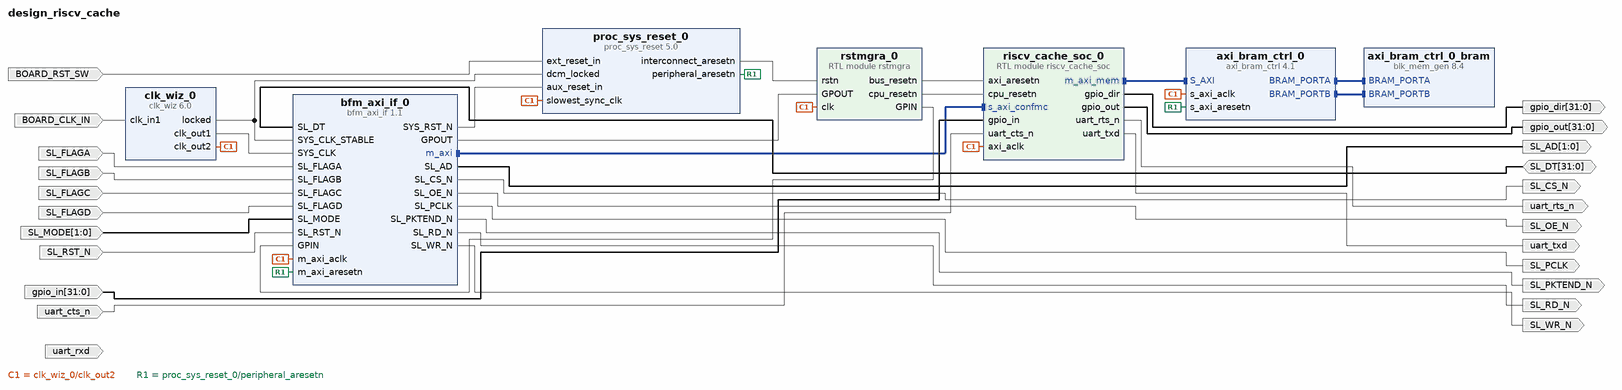
[diagram p0: block diagram of the top level]
# Vivado block design design_riscv_cache, xc7z020clg484-1, Vivado 2021.2
create_bd_design design_riscv_cache

create_bd_port -dir I -type clk BOARD_CLK_IN
set_property -dict {CONFIG.FREQ_HZ 100000000} [get_bd_ports BOARD_CLK_IN]
create_bd_port -dir I -type rst BOARD_RST_SW
set_property -dict {CONFIG.POLARITY ACTIVE_HIGH} [get_bd_ports BOARD_RST_SW]
create_bd_port -dir O -from 1 -to 0 SL_AD
create_bd_port -dir O SL_CS_N
create_bd_port -dir IO -from 31 -to 0 SL_DT
create_bd_port -dir I SL_FLAGA
create_bd_port -dir I SL_FLAGB
create_bd_port -dir I SL_FLAGC
create_bd_port -dir I SL_FLAGD
create_bd_port -dir I -from 1 -to 0 SL_MODE
create_bd_port -dir O SL_OE_N
create_bd_port -dir O SL_PCLK
create_bd_port -dir O SL_PKTEND_N
create_bd_port -dir O SL_RD_N
create_bd_port -dir I -type rst SL_RST_N
create_bd_port -dir O SL_WR_N
create_bd_port -dir I uart_cts_n
create_bd_port -dir O uart_rts_n
create_bd_port -dir I uart_rxd
create_bd_port -dir O uart_txd
create_bd_port -dir I -from 31 -to 0 gpio_in
create_bd_port -dir O -from 31 -to 0 gpio_out
create_bd_port -dir O -from 31 -to 0 gpio_dir

create_bd_cell -type ip -vlnv xilinx.com:ip:axi_bram_ctrl:4.1 axi_bram_ctrl_0
create_bd_cell -type ip -vlnv xilinx.com:ip:blk_mem_gen:8.4 axi_bram_ctrl_0_bram
set_property -dict {CONFIG.Memory_Type True_Dual_Port_RAM} [get_bd_cells axi_bram_ctrl_0_bram]
create_bd_cell -type ip -vlnv future-ds.com:user:bfm_axi_if:1.1 bfm_axi_if_0
create_bd_cell -type ip -vlnv xilinx.com:ip:clk_wiz:6.0 clk_wiz_0
set_property -dict [list \
  CONFIG.CLKOUT1_JITTER 137.143 \
  CONFIG.CLKOUT1_REQUESTED_OUT_FREQ 80 \
  CONFIG.CLKOUT2_JITTER 130.958 \
  CONFIG.CLKOUT2_PHASE_ERROR 98.575 \
  CONFIG.CLKOUT2_USED true \
  CONFIG.MMCM_CLKOUT0_DIVIDE_F 12.500 \
  CONFIG.MMCM_CLKOUT1_DIVIDE 10 \
  CONFIG.NUM_OUT_CLKS 2 \
  CONFIG.USE_RESET false \
] [get_bd_cells clk_wiz_0]
create_bd_cell -type ip -vlnv xilinx.com:ip:proc_sys_reset:5.0 proc_sys_reset_0
create_bd_cell -type module -reference riscv_cache_soc riscv_cache_soc_0
create_bd_cell -type module -reference rstmgra rstmgra_0

# ---- connections ----

connect_bd_intf_net [get_bd_intf_pins axi_bram_ctrl_0/BRAM_PORTA] [get_bd_intf_pins axi_bram_ctrl_0_bram/BRAM_PORTA]
connect_bd_intf_net [get_bd_intf_pins axi_bram_ctrl_0/BRAM_PORTB] [get_bd_intf_pins axi_bram_ctrl_0_bram/BRAM_PORTB]
connect_bd_intf_net [get_bd_intf_pins bfm_axi_if_0/m_axi] [get_bd_intf_pins riscv_cache_soc_0/s_axi_confmc]
connect_bd_intf_net [get_bd_intf_pins axi_bram_ctrl_0/S_AXI] [get_bd_intf_pins riscv_cache_soc_0/m_axi_mem]
connect_bd_net [get_bd_ports BOARD_CLK_IN] [get_bd_pins clk_wiz_0/clk_in1]
connect_bd_net [get_bd_ports BOARD_RST_SW] [get_bd_pins proc_sys_reset_0/ext_reset_in]
connect_bd_net [get_bd_ports SL_DT] [get_bd_pins bfm_axi_if_0/SL_DT]
connect_bd_net -net SL_FLAGA_0_1 [get_bd_ports SL_FLAGA] [get_bd_pins bfm_axi_if_0/SL_FLAGA]
connect_bd_net -net SL_FLAGB_0_1 [get_bd_ports SL_FLAGB] [get_bd_pins bfm_axi_if_0/SL_FLAGB]
connect_bd_net -net SL_FLAGC_0_1 [get_bd_ports SL_FLAGC] [get_bd_pins bfm_axi_if_0/SL_FLAGC]
connect_bd_net -net SL_FLAGD_0_1 [get_bd_ports SL_FLAGD] [get_bd_pins bfm_axi_if_0/SL_FLAGD]
connect_bd_net -net SL_MODE_0_1 [get_bd_ports SL_MODE] [get_bd_pins bfm_axi_if_0/SL_MODE]
connect_bd_net -net SL_RST_N_0_1 [get_bd_ports SL_RST_N] [get_bd_pins bfm_axi_if_0/SL_RST_N]
connect_bd_net [get_bd_pins bfm_axi_if_0/GPOUT] [get_bd_pins rstmgra_0/GPOUT]
connect_bd_net [get_bd_pins bfm_axi_if_0/SL_AD] [get_bd_ports SL_AD]
connect_bd_net [get_bd_pins bfm_axi_if_0/SL_CS_N] [get_bd_ports SL_CS_N]
connect_bd_net [get_bd_pins bfm_axi_if_0/SL_OE_N] [get_bd_ports SL_OE_N]
connect_bd_net [get_bd_pins bfm_axi_if_0/SL_PCLK] [get_bd_ports SL_PCLK]
connect_bd_net [get_bd_pins bfm_axi_if_0/SL_PKTEND_N] [get_bd_ports SL_PKTEND_N]
connect_bd_net [get_bd_pins bfm_axi_if_0/SL_RD_N] [get_bd_ports SL_RD_N]
connect_bd_net [get_bd_pins bfm_axi_if_0/SL_WR_N] [get_bd_ports SL_WR_N]
connect_bd_net [get_bd_pins clk_wiz_0/clk_out1] [get_bd_pins bfm_axi_if_0/SYS_CLK]
connect_bd_net [get_bd_pins clk_wiz_0/clk_out2] \
  [get_bd_pins axi_bram_ctrl_0/s_axi_aclk] [get_bd_pins bfm_axi_if_0/m_axi_aclk] \
  [get_bd_pins proc_sys_reset_0/slowest_sync_clk] [get_bd_pins riscv_cache_soc_0/axi_aclk] [get_bd_pins rstmgra_0/clk]
connect_bd_net [get_bd_pins clk_wiz_0/locked] [get_bd_pins bfm_axi_if_0/SYS_CLK_STABLE] [get_bd_pins proc_sys_reset_0/dcm_locked]
connect_bd_net [get_bd_ports gpio_in] [get_bd_pins riscv_cache_soc_0/gpio_in]
connect_bd_net [get_bd_pins proc_sys_reset_0/interconnect_aresetn] [get_bd_pins rstmgra_0/rstn]
connect_bd_net [get_bd_pins proc_sys_reset_0/peripheral_aresetn] [get_bd_pins axi_bram_ctrl_0/s_axi_aresetn] [get_bd_pins bfm_axi_if_0/m_axi_aresetn]
connect_bd_net [get_bd_pins riscv_cache_soc_0/gpio_dir] [get_bd_ports gpio_dir]
connect_bd_net [get_bd_pins riscv_cache_soc_0/gpio_out] [get_bd_ports gpio_out]
connect_bd_net [get_bd_pins riscv_cache_soc_0/uart_rts_n] [get_bd_ports uart_rts_n]
connect_bd_net [get_bd_pins riscv_cache_soc_0/uart_txd] [get_bd_ports uart_txd]
connect_bd_net [get_bd_pins rstmgra_0/GPIN] [get_bd_pins bfm_axi_if_0/GPIN]
connect_bd_net [get_bd_pins rstmgra_0/bus_resetn] [get_bd_pins riscv_cache_soc_0/axi_aresetn]
connect_bd_net [get_bd_pins rstmgra_0/cpu_resetn] [get_bd_pins riscv_cache_soc_0/cpu_resetn]
connect_bd_net [get_bd_ports uart_cts_n] [get_bd_pins riscv_cache_soc_0/uart_cts_n]
# net uart_rxd_1 has one end: uart_rxd
connect_bd_net -net util_vector_logic_0_Res [get_bd_pins bfm_axi_if_0/SYS_RST_N] [get_bd_pins proc_sys_reset_0/aux_reset_in]

# ---- address map ----
assign_bd_address -offset 0x00000000 -range 4G -target_address_space [get_bd_addr_spaces bfm_axi_if_0/m_axi] [get_bd_addr_segs riscv_cache_soc_0/s_axi_confmc/reg0]
assign_bd_address -offset 0x02000000 -range 128K -target_address_space [get_bd_addr_spaces riscv_cache_soc_0/m_axi_mem] [get_bd_addr_segs axi_bram_ctrl_0/S_AXI/Mem0]

validate_bd_design
save_bd_design
